# Altium schematic sheet PowerGroup.SchDoc
size A4
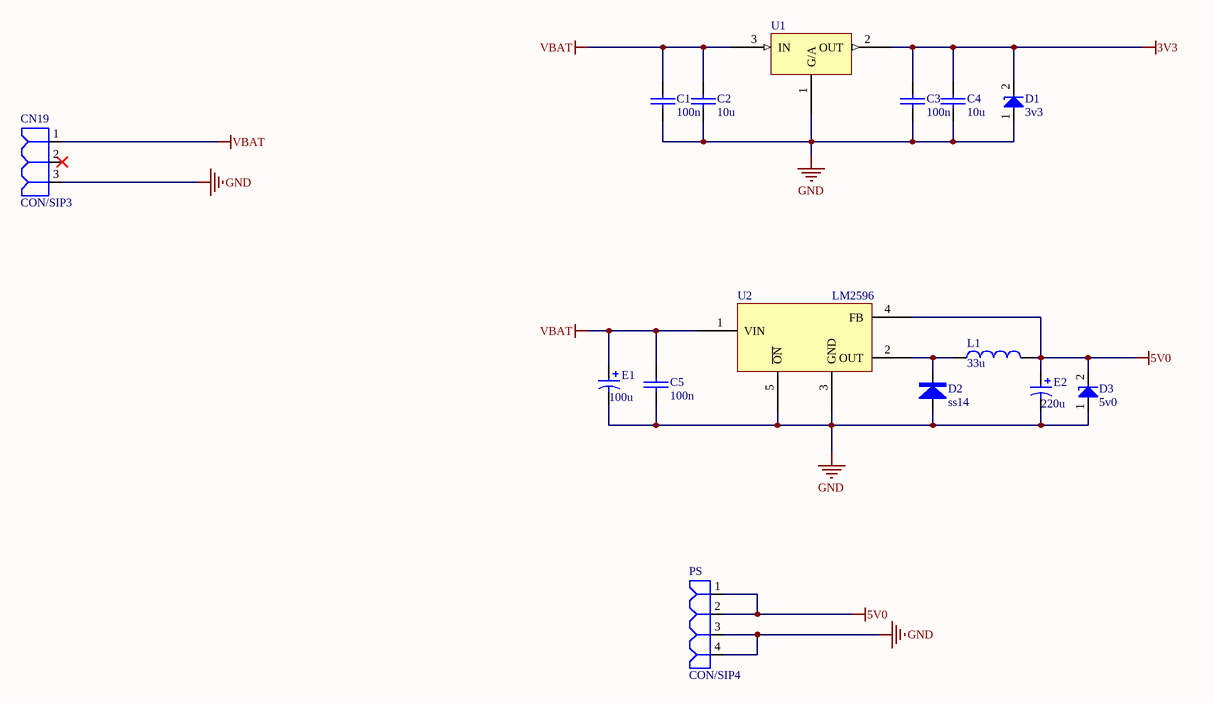
[diagram p0: PowerGroup.SchDoc]

## Parts
C1  100n  [C0402]
C2  10u  [C0402]
C3  100n  [C0402]
C4  10u  [C0402]
C5  100n  [C0603]
CN19  CON/SIP3  [HDR1X3]
D1  3v3  [D1206]
D2  ss14  [DO-214]
D3  5v0  [D1206]
E1  100u  [CAP-E SMD-A]
E2  220u  [CAP-E SMD-A]
L1  33u  [L7X7]
PS  CON/SIP4  [HDR1X4]
U1  AMS1117-XX  [SOT223]  (value not drawn)
U2  LM2596  [TO263S]

## Nets
3V3: C3.2 C4.2 D1.2 U1.2(OUT)
5V0: D3.2 E2.1 L1.2 PS.1 PS.2 U2.4(FB)
GND: C1.1 C2.1 C3.1 C4.1 C5.2 CN19.3 D1.1 D2.1(A) D3.1 E1.2 E2.2 PS.3 PS.4 U1.1(G/A) U2.3(GND) U2.5(~{ON})
VBAT: C1.2 C2.2 C5.1 CN19.1 E1.1 U1.3(IN) U2.1(VIN)
NetD2_2: D2.2(K) L1.1 U2.2(OUT)

Not connected (* = marked no-connect by the designer): CN19 2*

## Library data of the parts
C1-C5 = Capacitor: 电容
D1 D3 = DIODE稳压
D2 = DIODE: 二极管
E1 E2 = Capacitor-Polarity: 极性电容
L1 = INDUCTOR
U1 = AMS1117-XX: 稳压芯片
U2 = LM2596: DCDCBUCK